# Altium schematic sheet RoBeast_Driver.SchDoc: Stepper Motor Drivers
size A4; ApprovedBy: CR; DrawnBy: VM & IG; Revision: V1; SheetNumber: 4; SheetTotal: 9
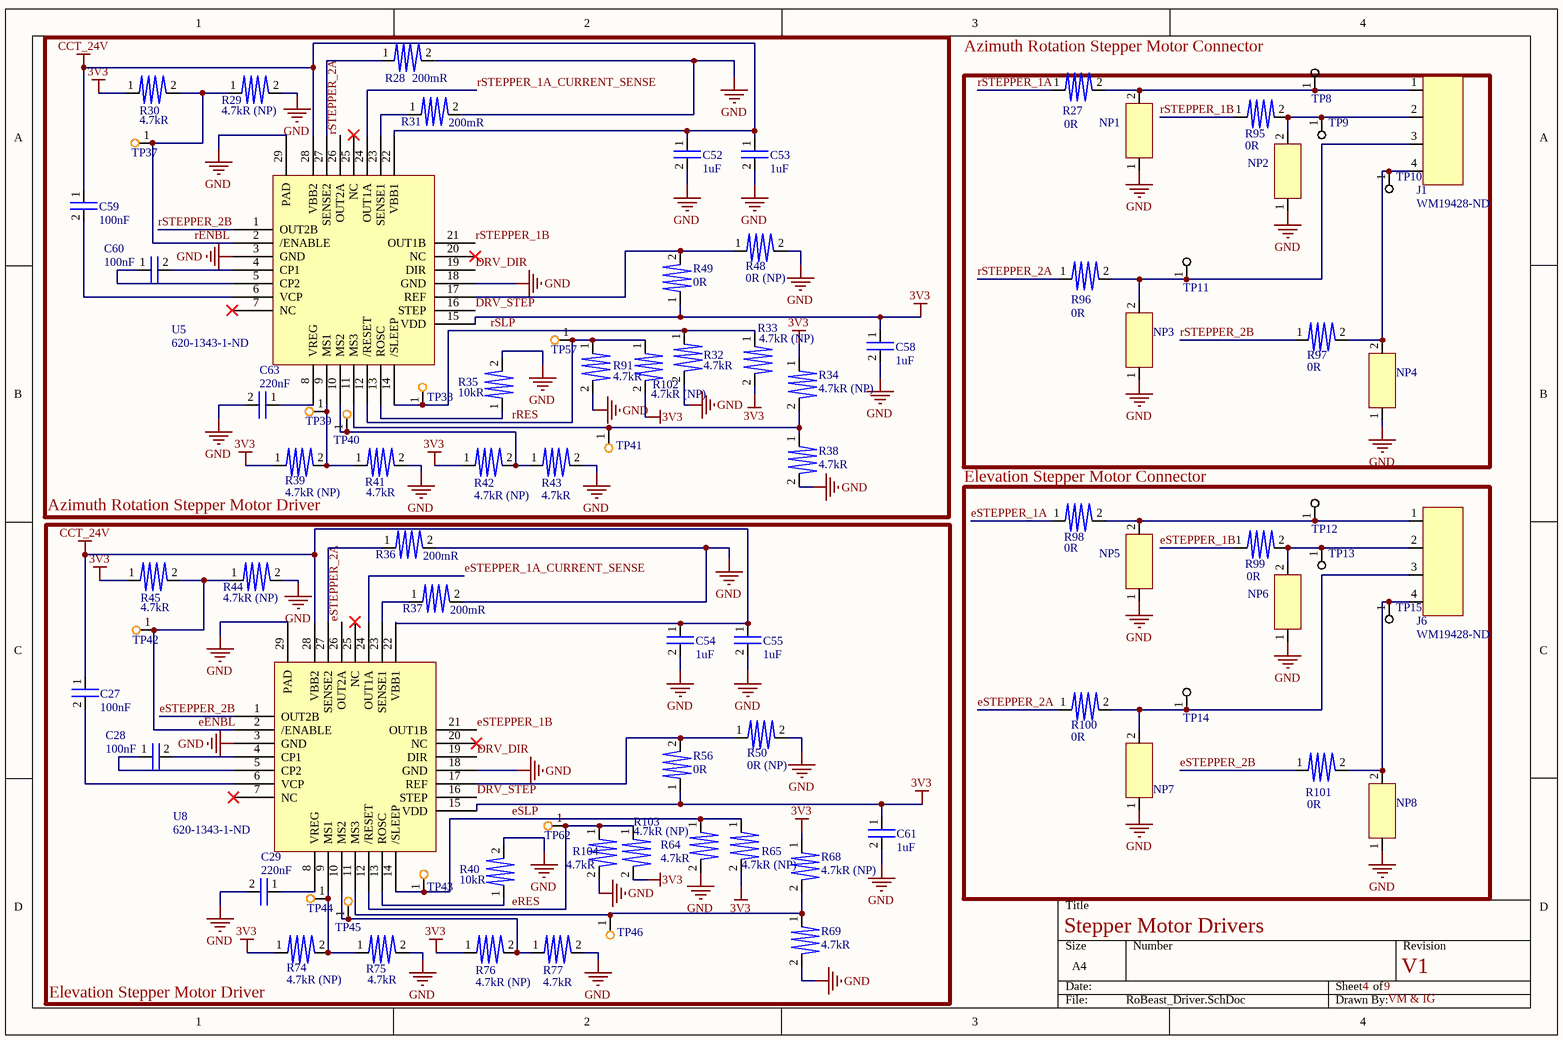
[diagram p0: RoBeast_Driver.SchDoc]

## Parts
C27  100nF  [0805]
C28  100nF  [0805]
C29  220nF  [0805]
C52  1uF  [0805]
C53  1uF  [0805]
C54  1uF  [0805]
C55  1uF  [0805]
C58  1uF  [0805]
C59  100nF  [0805]
C60  100nF  [0805]
C61  1uF  [0805]
C63  220nF  [0805]
J1  Supplier Part Number: WM19428-ND  [0015246043]  (hidden comment: 4 Pin Connector)
J6  Supplier Part Number: WM19428-ND  [0015246043]  (hidden comment: 4 Pin Connector)
NP1  Not Populated  [0805]  (value not drawn)
NP2  Not Populated  [0805]  (value not drawn)
NP3  Not Populated  [0805]  (value not drawn)
NP4  Not Populated  [0805]  (value not drawn)
NP5  Not Populated  [0805]  (value not drawn)
NP6  Not Populated  [0805]  (value not drawn)
NP7  Not Populated  [0805]  (value not drawn)
NP8  Not Populated  [0805]  (value not drawn)
R27  0R  [0805]
R28  200mR  [0805]
R29  4.7kR (NP)  [0805]
R30  4.7kR  [0805]
R31  200mR  [0805]
R32  4.7kR  [0805]
R33  4.7kR (NP)  [0805]
R34  4.7kR (NP)  [0805]
R35  10kR  [0805]
R36  200mR  [0805]
R37  200mR  [0805]
R38  4.7kR  [0805]
R39  4.7kR (NP)  [0805]
R40  10kR  [0805]
R41  4.7kR  [0805]
R42  4.7kR (NP)  [0805]
R43  4.7kR  [0805]
R44  4.7kR (NP)  [0805]
R45  4.7kR  [0805]
R48  0R (NP)  [0805]
R49  0R  [0805]
R50  0R (NP)  [0805]
R56  0R  [0805]
R64  4.7kR  [0805]
R65  4.7kR (NP)  [0805]
R68  4.7kR (NP)  [0805]
R69  4.7kR  [0805]
R74  4.7kR (NP)  [0805]
R75  4.7kR  [0805]
R76  4.7kR (NP)  [0805]
R77  4.7kR  [0805]
R91  4.7kR  [0805]
R95  0R  [0805]
R96  0R  [0805]
R97  0R  [0805]
R98  0R  [0805]
R99  0R  [0805]
R100  0R  [0805]
R101  0R  [0805]
R102  4.7kR (NP)  [0805]
R103  4.7kR (NP)  [0805]
R104  4.7kR  [0805]
TP8  Test Point  [RCWCTE]  (value not drawn)
TP9  Test Point  [RCWCTE]  (value not drawn)
TP10  Test Point  [RCWCTE]  (value not drawn)
TP11  Test Point  [RCWCTE]  (value not drawn)
TP12  Test Point  [RCWCTE]  (value not drawn)
TP13  Test Point  [RCWCTE]  (value not drawn)
TP14  Test Point  [RCWCTE]  (value not drawn)
TP15  Test Point  [RCWCTE]  (value not drawn)
TP37  Test Point  [Test Point]  (value not drawn)
TP38  Test Point  [Test Point]  (value not drawn)
TP39  Test Point  [Test Point]  (value not drawn)
TP40  Test Point  [Test Point]  (value not drawn)
TP41  Test Point  [Test Point]  (value not drawn)
TP42  Test Point  [Test Point]  (value not drawn)
TP43  Test Point  [Test Point]  (value not drawn)
TP44  Test Point  [Test Point]  (value not drawn)
TP45  Test Point  [Test Point]  (value not drawn)
TP46  Test Point  [Test Point]  (value not drawn)
TP57  Test Point  [Test Point]  (value not drawn)
TP62  Test Point  [Test Point]  (value not drawn)
U5  Supplier Part Number: 620-1343-1-ND  [A4988SETTR-T]  (hidden comment: Stepper Motor Driver)
U8  Supplier Part Number: 620-1343-1-ND  [A4988SETTR-T]  (hidden comment: Stepper Motor Driver)

## Blocks framed on the sheet
Azimuth Rotation Stepper Motor Driver: C52 C53 C58-C60 C63 R28-R35 R38 R39 R41-R43 R48 R49 R91 R102 TP37-TP41 TP57 U5
Azimuth Rotation Stepper Motor Connector: J1 NP1-NP4 R27 R95-R97 TP8-TP11
Elevation Stepper Motor Connector: J6 NP5-NP8 R98-R101 TP12-TP15

## Nets
3V3: C58.1 C61.1 R30.1 R33.2 R34.1 R39.1 R42.1 R45.1 R49.1 R56.1 R65.2 R68.1 R74.1 R76.1 R102.2 R103.2 U5.15(VDD) U8.15(VDD)
CCT_24V: C27.1 C52.1 C53.1 C54.1 C55.1 C59.1 U5.22(VBB1) U5.28(VBB2) U8.22(VBB1) U8.28(VBB2)
GND: C29.2 C52.2 C53.2 C54.2 C55.2 C58.2 C61.2 C63.2 NP1.1 NP2.1 NP3.1 NP4.1 NP5.1 NP6.1 NP7.1 NP8.1 R28.2 R29.2 R31.2 R32.2 R35.2 R36.2 R37.2 R38.2 R40.2 R41.2 R43.2 R44.2 R48.2 R50.2 R64.2 R69.2 R75.2 R77.2 R91.2 R104.2 U5.3(GND) U5.18(GND) U5.29(PAD) U8.3(GND) U8.18(GND) U8.29(PAD)
DRV_DIR: U5.19(DIR) U8.19(DIR)
DRV_STEP: U5.16(STEP) U8.16(STEP)
eENBL: R44.1 R45.2 TP42.1 U8.2(/ENABLE)
eRES: R103.1 R104.1 TP62.1 U8.12(/RESET)
eSLP: R64.1 R65.1 TP43.1 U8.14(/SLEEP)
eSTEPPER_1A: R98.1
eSTEPPER_1A_CURRENT_SENSE: U8.24(OUT1A)
eSTEPPER_1B: R99.1 U8.21(OUT1B)
eSTEPPER_2A: R100.1 U8.26(OUT2A)
eSTEPPER_2B: R101.1 U8.1(OUT2B)
rENBL: R29.1 R30.2 TP37.1 U5.2(/ENABLE)
rRES: R91.1 R102.1 TP57.1 U5.12(/RESET)
rSLP: R32.1 R33.1 TP38.1 U5.14(/SLEEP)
rSTEPPER_1A: R27.1
rSTEPPER_1A_CURRENT_SENSE: U5.24(OUT1A)
rSTEPPER_1B: R95.1 U5.21(OUT1B)
rSTEPPER_2A: R96.1 U5.26(OUT2A)
rSTEPPER_2B: R97.1 U5.1(OUT2B)
NetC27_2: C27.2 U8.6(VCP)
NetC28_1: C28.1 U8.5(CP2)
NetC28_2: C28.2 U8.4(CP1)
NetC29_1: C29.1 U8.8(VREG)
NetC59_2: C59.2 U5.6(VCP)
NetC60_1: C60.1 U5.5(CP2)
NetC60_2: C60.2 U5.4(CP1)
NetC63_1: C63.1 U5.8(VREG)
NetJ1_1: J1.1 NP1.2 R27.2 TP8.1
NetJ1_2: J1.2 NP2.2 R95.2 TP9.1
NetJ1_3: J1.3 NP3.2 R96.2 TP11.1
NetJ1_4: J1.4 NP4.2 R97.2 TP10.1
NetJ6_1: J6.1 NP5.2 R98.2 TP12.1
NetJ6_2: J6.2 NP6.2 R99.2 TP13.1
NetJ6_3: J6.3 NP7.2 R100.2 TP14.1
NetJ6_4: J6.4 NP8.2 R101.2 TP15.1
NetR28_1: R28.1 U5.27(SENSE2)
NetR31_1: R31.1 U5.23(SENSE1)
NetR34_2: R34.2 R38.1 TP41.1 U5.11(MS3)
NetR35_1: R35.1 U5.13(ROSC)
NetR36_1: R36.1 U8.27(SENSE2)
NetR37_1: R37.1 U8.23(SENSE1)
NetR39_2: R39.2 R41.1 TP39.1 U5.9(MS1)
NetR40_1: R40.1 U8.13(ROSC)
NetR42_2: R42.2 R43.1 TP40.1 U5.10(MS2)
NetR48_1: R48.1 R49.2 U5.17(REF)
NetR50_1: R50.1 R56.2 U8.17(REF)
NetR68_2: R68.2 R69.1 TP46.1 U8.11(MS3)
NetR74_2: R74.2 R75.1 TP44.1 U8.9(MS1)
NetR76_2: R76.2 R77.1 TP45.1 U8.10(MS2)

Not connected (* = marked no-connect by the designer): U5 7(NC)* 20(NC)* 25(NC)*; U8 7(NC)* 20(NC)* 25(NC)*

## Notes on the sheet
- (near R74) Elevation Stepper Motor Driver

## Library data of the parts
C27 C28 C59 C60 = C0805C104J5RAC7800: Ceramic Capacitor, Multilayer, Ceramic, 50V, 5% +Tol, 5% -Tol, X7R, 15% TC, 0.1uF, Surface Mount, 0805; Manufacturer: KEMET; Manufacturer Part Number: C0805C104J5RACTU; Multilayer: Yes; Supplier 1: Digikey; RoHS: Yes; Category: Ceramic Capacitors; Stock 1: 605061; Pricing 1: 1=0.18, 10=0.122, 50=0.0732, 100=0.0576, 500=0.04252, 1000=0.03519 (USD); Mount: Surface Mount; Number of Pins: 2; Dielectric Material: Ceramic; Package Shape: Rectangular; Size Code: 0805; Terminal Finish: Nickel; Min Operating Temperature: -55°C; Max Operating Temperature: 125°C; JESD-609 Code: e3; Capacitor Type: Ceramic; Negative Tolerance: 5%; Packaging: Tape and Reel; Positive Tolerance: 5%; Rated DC Voltage (URdc): 50V; Temperature Characteristics Code: X7R; Termination: Wraparound; Reach SVHC Compliant: Yes; RoHS Compliant: Yes; ComponentLink1URL: http://capacitoredge.kemet.com:80/capedge2/intellispec.jsp?pn=C0805C104J5RACTU&displayPN=C0805C104J5RACTU&src-supplier=IHS+Markit; ComponentLink1Description: http://capacitoredge.kemet.com:80/capedge2/intellispec.jsp?pn=C0805C104J5RACTU&displayPN=C0805C104J5RACTU&src-supplier=IHS+Markit; ComponentLink2URL: https://datasheet.ciiva.com/7842/1732721-7842179.pdf?src-supplier=Element14; ComponentLink2Description: https://datasheet.ciiva.com/7842/1732721-7842179.pdf?src-supplier=Element14; ComponentLink3URL: https://datasheet.ciiva.com/28682/1851736-28682223.pdf?src-supplier=Element14; ComponentLink3Description: https://datasheet.ciiva.com/28682/1851736-28682223.pdf?src-supplier=Element14; ComponentLink4URL: https://datasheet.ciiva.com/7258/1828800-7258413.pdf?src-supplier=Newark; ComponentLink4Description: https://datasheet.ciiva.com/7258/1828800-7258413.pdf?src-supplier=Newark; ComponentLink5URL: https://datasheet.ciiva.com/14589/70095383-14589015.pdf?src-supplier=Allied+Electronics; ComponentLink5Description: https://datasheet.ciiva.com/14589/70095383-14589015.pdf?src-supplier=Allied+Electronics; ComponentLink6URL: https://datasheet.ciiva.com/5417/kem-c1002-x7r-smd-5417352.pdf?src-supplier=Mouser; ComponentLink6Description: https://datasheet.ciiva.com/5417/kem-c1002-x7r-smd-5417352.pdf?src-supplier=Mouser; ComponentLink7URL: https://datasheet.ciiva.com/39122/docfinderpartnumberc0402c102k5ractu-39122924.pdf?src-supplier=Onlinecomponents.com; ComponentLink7Description: https://datasheet.ciiva.com/39122/docfinderpartnumberc0402c102k5ractu-39122924.pdf?src-supplier=Onlinecomponents.com; Supplier Part Number 1: 399-C0805C104J5RAC7800CT-ND; Capacitance: 100nF
C29 C63 = C0805C224J1RECAUTO: Ceramic Capacitor, Multilayer, Ceramic, 100V, 5% +Tol, 5% -Tol, X7R, 15% TC, 0.22uF, Surface Mount, 0805; Manufacturer: KEMET; Supplier 1: Digikey; Manufacturer Part Number: C0805C224J1RECAUTO; RoHS: Yes; Category: Ceramic Capacitors; Stock 1: 3363; Pricing 1: 1=0.32, 10=0.207, 50=0.145, 100=0.1171, 500=0.08702, 1000=0.07614 (USD); Number of Pins: 2; Dielectric Material: Ceramic; Capacitor Type: Ceramic; Reach SVHC Compliant: Yes; RoHS Compliant: Yes; ComponentLink1URL: https://datasheet.ciiva.com:443/pdfs/VipMasterIC/IC/KEME/KEME-S-A0008958450/KEME-S-A0008958450-1.pdf?src-supplier=IHS+Markit; ComponentLink1Description: https://datasheet.ciiva.com:443/pdfs/VipMasterIC/IC/KEME/KEME-S-A0008958450/KEME-S-A0008958450-1.pdf?src-supplier=IHS+Markit; ComponentLink2URL: https://api.kemet.com/component-edge/download/datasheet/C0805C224J1RECAUTO.pdf?src-supplier=Digikey; ComponentLink2Description: https://api.kemet.com/component-edge/download/datasheet/C0805C224J1RECAUTO.pdf?src-supplier=Digikey; Supplier Part Number 1: 399-C0805C224J1RECAUTOCT-ND
C52-C55 C58 C61 = CC0805JKX7R9BB105: Ceramic Capacitor, Multilayer, Ceramic, 50V, 5% +Tol, 5% -Tol, X7R, 15% TC, 1uF, Surface Mount, 0805; Manufacturer: Yageo; Supplier 1: Digikey; Manufacturer Part Number: CC0805JKX7R9BB105; RoHS: Yes; Category: Ceramic Capacitors; Stock 1: 50247; Pricing 1: 1=0.32, 10=0.207, 50=0.1454, 100=0.1174, 500=0.08724, 1000=0.07633 (USD); ComponentLink1URL: https://datasheet.ciiva.com:443/pdfs/VipMasterIC/IC/YAGO/YAGO-S-A0003557223/YAGO-S-A0003557223-1.pdf?src-supplier=IHS+Markit; ComponentLink1Description: https://datasheet.ciiva.com:443/pdfs/VipMasterIC/IC/YAGO/YAGO-S-A0003557223/YAGO-S-A0003557223-1.pdf?src-supplier=IHS+Markit; ComponentLink2URL: http://www.yageo.com/documents/recent/UPY-GPHC_X7R_6.3V-to-50V_18.pdf?src-supplier=Digikey; ComponentLink2Description: http://www.yageo.com/documents/recent/UPY-GPHC_X7R_6.3V-to-50V_18.pdf?src-supplier=Digikey; Supplier Part Number 1: 311-3498-1-ND
J1 J6 = 0015246043: Rectangular Power Connector, 4 Contact(s), Male, Solder Terminal, Receptacle; Manufacturer: Molex; Manufacturer Series: 42404; Connector Type: Power,Rectangular; Option: General Purpose; Empty Shell: No; Mating Information: MULTIPLE MATING PARTS AVAILABLE; Number of Contacts: 4; Contact Style: SQ PIN-SKT; Insertion Force-Max: 14.6784N; Number Of Connectors: 1; Number of Rows Loaded: 2; Body Breadth: 0.591inch; Body Depth: 0.815inch; Mounting Option 1: GUIDE SLOT; Reference Standard: UL; Reliability: COMMERCIAL; Contact Resistance: 10mR; Insulation Resistance: 1GR; Withdrawl Force-Min: 1.0008N; Board Mounting Option: SPLIT BOARD LOCK; Dielectric Withstanding Voltage (AC): 2.2kV; Durability: 30Cycles; Polarization Key: POLARIZED HOUSING; Rated Current (Signal): 8A; Mating Contact Pitch: 0.165inch; Mounting Option 2: LOCKING; PCB Contact Row Spacing: 5.5118mm; Plating Thickness: 30uin; Manufacturer Part Number: 15-24-6043; RoHS: Yes; Category: Headers and Wire Housings; Contact Finish - Mating: NOT SPECIFIED; Shell Material: POLYAMIDE66; Insulation Color: Natural; Insulation Material: Nylon; Contact Gender: Male; Filter Feature: No; Mixed Contacts: No; Termination: Solder; Body/Shell Style: RECEPTACLE; Mounting Style: RIGHT ANGLE; Flammability Rating: UL94 V-0; Reach SVHC Compliant: Yes; RoHS Compliant: Yes; DIN Conformance: No; IEC Conformance: No; MIL Conformance: No; ComponentLink1URL: https://datasheet.ciiva.com:443/pdfs/VipMasterIC/IC/MOLE/MOLES39673/MOLES39673-1.pdf?src-supplier=IHS+Markit; ComponentLink1Description: https://datasheet.ciiva.com:443/pdfs/VipMasterIC/IC/MOLE/MOLES39673/MOLES39673-1.pdf?src-supplier=IHS+Markit; ComponentLink2URL: https://datasheet.ciiva.com/16095/789440015246043-pcb-headers-16095349.pdf?src-supplier=Onlinecomponents.com; ComponentLink2Description: https://datasheet.ciiva.com/16095/789440015246043-pcb-headers-16095349.pdf?src-supplier=Onlinecomponents.com; ComponentLink3URL: https://datasheet.ciiva.com/30160/0015246043-pcb-headers-30160175.pdf?src-supplier=Onlinecomponents.com; ComponentLink3Description: https://datasheet.ciiva.com/30160/0015246043-pcb-headers-30160175.pdf?src-supplier=Onlinecomponents.com; Supplier: Digikey; Stock: 3180; Pricing: 1=2.55, 10=2.244, 880=1.78517, 1760=1.42814, 5280=1.32613 (USD); Mounting Technology: Board; Min Operating Temperature: -40°C; Max Operating Temperature: 105°C; Contact Pattern: RECTANGULAR; Number Of PCB Rows: 2; PCB Contact Pattern: RECTANGULAR; Mating Contact Row Spacing: 0.165inch; Terminal Length: 0.13inch; Terminal Pitch: 4.191mm
NP1-NP8 = NP
R27 R48-R50 R56 R95-R101 = RMCF0805ZT0R00: Fixed Resistor, Metal Glaze/thick Film, 0.125W, 0ohm, Surface Mount, 0805; Manufacturer: Stackpole Electronics; Rated Power Dissipation (P): 125mW; Rated Temperature: 70°C; Working Voltage: 150V; Package Height: 0.5mm; Package Length: 2mm; Package Width: 1.25mm; Reference Standard: AEC-Q200; Supplier 1: Digikey; Manufacturer Part Number: RMCF0805ZT0R00; RoHS: Yes; Category: Chip SMD Resistors; Stock 1: 1154169; Pricing 1: 1=0.1, 10=0.017, 25=0.0128, 50=0.0096, 100=0.0068, 250=0.00544, 500=0.00436, 1000=0.00321 (USD); Mount: Surface Mount; Number of Pins: 2; Package Shape: Rectangular; Size Code: 0805; Terminal Finish: Nickel; Min Operating Temperature: -55°C; Max Operating Temperature: 155°C; JESD-609 Code: e3; Resistor Type: FIXED RESISTOR; Construction: Rectangular; Package Style: SMTMeter; Packaging: Tape and Reel; Resistance: 0R; Technology: METAL GLAZE/THICK FILM; Termination: Wraparound; Reach SVHC Compliant: Yes; RoHS Compliant: Yes; ComponentLink1URL: https://datasheet.ciiva.com:443/pdfs/VipMasterIC/IC/SEIE/SEIE-S-A0007077258/SEIE-S-A0007077258-1.pdf?src-supplier=IHS+Markit; ComponentLink1Description: https://datasheet.ciiva.com:443/pdfs/VipMasterIC/IC/SEIE/SEIE-S-A0007077258/SEIE-S-A0007077258-1.pdf?src-supplier=IHS+Markit; ComponentLink2URL: https://datasheet.ciiva.com/15193/getdatasheetpartid-360417-15193658.pdf?src-supplier=Verical; ComponentLink2Description: https://datasheet.ciiva.com/15193/getdatasheetpartid-360417-15193658.pdf?src-supplier=Verical; Supplier Part Number 1: RMCF0805ZT0R00CT-ND
R28 R31 R36 R37 = D1WEL0805CR200F-T5: Res 0805 50PPM 0.2 Ohm 1.0% 0.75; Manufacturer: Thin Film Tech; Supplier 1: Digikey; Manufacturer Part Number: D1WEL0805CR200F-T5; RoHS: No; Category: Chip SMD Resistors; Stock 1: 11324; Pricing 1: 1=0.46, 10=0.337, 25=0.2704, 50=0.2008, 100=0.1417, 250=0.1262, 500=0.10818, 1000=0.08242 (USD); Supplier Part Number 1: 4463-D1WEL0805CR200F-T5CT-ND
R29 R30 R32-R34 R38 R39 R41-R45 R64 R65 R68 R69 R74-R77 R91 R102-R104 = RCC08054K70FKEA: Fixed Resistor, Metal Glaze/thick Film, 0.25W, 4700ohm, 200V, 1% +/-Tol, 100ppm/Cel, Surface Mount, 0805; Manufacturer: Vishay Dale; Supplier 1: Digikey; Manufacturer Part Number: RCC08054K70FKEA; RoHS: Yes; Category: Chip SMD Resistors; Stock 1: 96612; Pricing 1: 1=0.15, 10=0.069, 50=0.0454, 100=0.0385, 500=0.0271, 1000=0.0236 (USD); Supplier Part Number 1: 541-RCC08054K70FKEACT-ND
R35 R40 = RMCF0805FT10K0: Fixed Resistor, Metal Glaze/thick Film, 0.125W, 10000ohm, 150V, 1% +/-Tol, 100ppm/Cel, Surface Mount, 0805; Manufacturer: Stackpole Electronics; Rated Power Dissipation (P): 125mW; Rated Temperature: 70°C; Temperature Coefficient: 100ppm/°C; Package Height: 0.5mm; Package Length: 2mm; Package Width: 1.25mm; Reference Standard: AEC-Q200; Supplier 1: Digikey; Manufacturer Part Number: RMCF0805FT10K0; RoHS: Yes; Category: Chip SMD Resistors; Stock 1: 3602197; Pricing 1: 1=0.1, 10=0.02, 50=0.0124, 100=0.0103, 500=0.007, 1000=0.00601 (USD); Mount: Surface Mount; Number of Pins: 2; Package Shape: Rectangular; Size Code: 0805; Terminal Finish: Nickel; Min Operating Temperature: -55°C; Max Operating Temperature: 155°C; Tolerance: 1%; JESD-609 Code: e3; Resistor Type: FIXED RESISTOR; Construction: Rectangular; Package Style: SMTMeter; Packaging: Tape and Reel; Resistance: 10kR; Technology: METAL GLAZE/THICK FILM; Termination: Wraparound; Working Voltage: 150V; Reach SVHC Compliant: Yes; RoHS Compliant: Yes; ComponentLink1URL: https://datasheet.ciiva.com:443/pdfs/VipMasterIC/IC/SEIE/SEIE-S-A0009541969/SEIE-S-A0009541969-1.pdf?src-supplier=IHS+Markit; ComponentLink1Description: https://datasheet.ciiva.com:443/pdfs/VipMasterIC/IC/SEIE/SEIE-S-A0009541969/SEIE-S-A0009541969-1.pdf?src-supplier=IHS+Markit; ComponentLink2URL: https://datasheet.ciiva.com/15193/getdatasheetpartid-362046-15193525.pdf?src-supplier=Verical; ComponentLink2Description: https://datasheet.ciiva.com/15193/getdatasheetpartid-362046-15193525.pdf?src-supplier=Verical; Supplier Part Number 1: RMCF0805FT10K0CT-ND
TP8-TP15 = RCWCTE: Testing/Accessories; Manufacturer: KOA Speer; Rated Temperature: 70°C; Resistance: 0R; Package Height: 2mm; Package Length: 3.2mm; Package Width: 1.6mm; Reference Standard: AEC-Q200; Supplier 1: Digikey; Manufacturer Part Number: RCWCTE; RoHS: Yes; Category: Chip SMD Resistors; Stock 1: 132357; Pricing 1: 1=0.16, 10=0.137, 25=0.1212, 50=0.1132, 100=0.105, 250=0.09292, 500=0.08888, 1000=0.07272 (USD); Mount: Surface Mount; Number of Pins: 2; Package Shape: Rectangular; Size Code: 1206; Terminal Finish: Copper; Min Operating Temperature: -55°C; Max Operating Temperature: 125°C; JESD-609 Code: e2; Resistor Type: FIXED RESISTOR; Construction: Chip; Package Style: SMTMeter; Packaging: Tape and Reel; Termination: Wraparound; Reach SVHC Compliant: Yes; RoHS Compliant: Yes; ComponentLink1URL: https://datasheet.ciiva.com:443/pdfs/VipMasterIC/IC/KOAS/KOASS03065/KOASS03065-1.pdf?src-supplier=IHS+Markit; ComponentLink1Description: https://datasheet.ciiva.com:443/pdfs/VipMasterIC/IC/KOAS/KOASS03065/KOASS03065-1.pdf?src-supplier=IHS+Markit; ComponentLink2URL: https://datasheet.ciiva.com/34302/1876186-34302940.pdf?src-supplier=Jameco; ComponentLink2Description: https://datasheet.ciiva.com/34302/1876186-34302940.pdf?src-supplier=Jameco; ComponentLink3URL: https://datasheet.ciiva.com/5556/rc-5556236.pdf?src-supplier=Mouser; ComponentLink3Description: https://datasheet.ciiva.com/5556/rc-5556236.pdf?src-supplier=Mouser; ComponentLink4URL: https://datasheet.ciiva.com/26821/getdatasheetpartid-110197-26821157.pdf?src-supplier=Verical; ComponentLink4Description: https://datasheet.ciiva.com/26821/getdatasheetpartid-110197-26821157.pdf?src-supplier=Verical; Supplier Part Number 1: 2019-RCWCTECT-ND
U5 U8 = A4988SETTR-T: Stepper Motor Controller, 2A, DMOS; Manufacturer: Allegro MicroSystems; Channels: 1; Power Supplies: 35V; Supply Current-Max (Isup): 8mA; Max Supply Voltage: 5.5V; Min Supply Voltage: 3V; Nominal Supply Voltage: 3.3V; Qualification Status: Not Qualified; Supplier: Digikey; Manufacturer Part Number: A4988SETTR-T; RoHS: Yes; Category: Motor Drivers; Stock: 34042; Pricing: 1=3.05, 10=2.74, 25=2.5908, 100=2.2452, 250=2.13008, 500=1.91132 (USD); Case/Package: HVQCCN; Pins: 28; Package Shape: Square; Terminal Finish: Tin; Min Operating Temperature: -20°C; Max Operating Temperature: 85°C; JESD-609 Code: e3; Throw Configuration: STEPPER MOTOR CONTROLLER; Moisture Sensitivity Level: 2; Max Output current: 2A; Package Style: CHIP CARRIER, HEAT SINK/SLUG, VERY THIN PROFILEMeter; Surface Mount: Yes; Technology: NMOS; Terminal Form: No Lead; Terminal Position: QUAD; Length: 5mm; Width: 5mm; Height - Seated (Max): 1mm; Terminal Pitch: 0.5mm; Temperature Grade: OTHER; Reach SVHC Compliant: Yes; RoHS Compliant: Yes; ComponentLink1URL: https://datasheet.ciiva.com:443/pdfs/VipMasterIC/IC/ALLE/ALLE-S-A0001477902/ALLE-S-A0001477902-1.pdf?src-supplier=IHS+Markit; ComponentLink1Description: https://datasheet.ciiva.com:443/pdfs/VipMasterIC/IC/ALLE/ALLE-S-A0001477902/ALLE-S-A0001477902-1.pdf?src-supplier=IHS+Markit; ComponentLink2URL: https://datasheet.ciiva.com/1147/1481258-1147170.pdf?src-supplier=Element14; ComponentLink2Description: https://datasheet.ciiva.com/1147/1481258-1147170.pdf?src-supplier=Element14; ComponentLink3URL: https://datasheet.ciiva.com/15109/getdatasheetpartid-557828-15109654.pdf?src-supplier=Verical; ComponentLink3Description: https://datasheet.ciiva.com/15109/getdatasheetpartid-557828-15109654.pdf?src-supplier=Verical; ComponentLink4URL: https://datasheet.ciiva.com/1608/a4988-datasheet-1608449.pdf?src-supplier=Newark; ComponentLink4Description: https://datasheet.ciiva.com/1608/a4988-datasheet-1608449.pdf?src-supplier=Newark; ComponentLink5URL: https://datasheet.ciiva.com/3229/a4988-datasheet-3229532.pdf?src-supplier=Avnet; ComponentLink5Description: https://datasheet.ciiva.com/3229/a4988-datasheet-3229532.pdf?src-supplier=Avnet